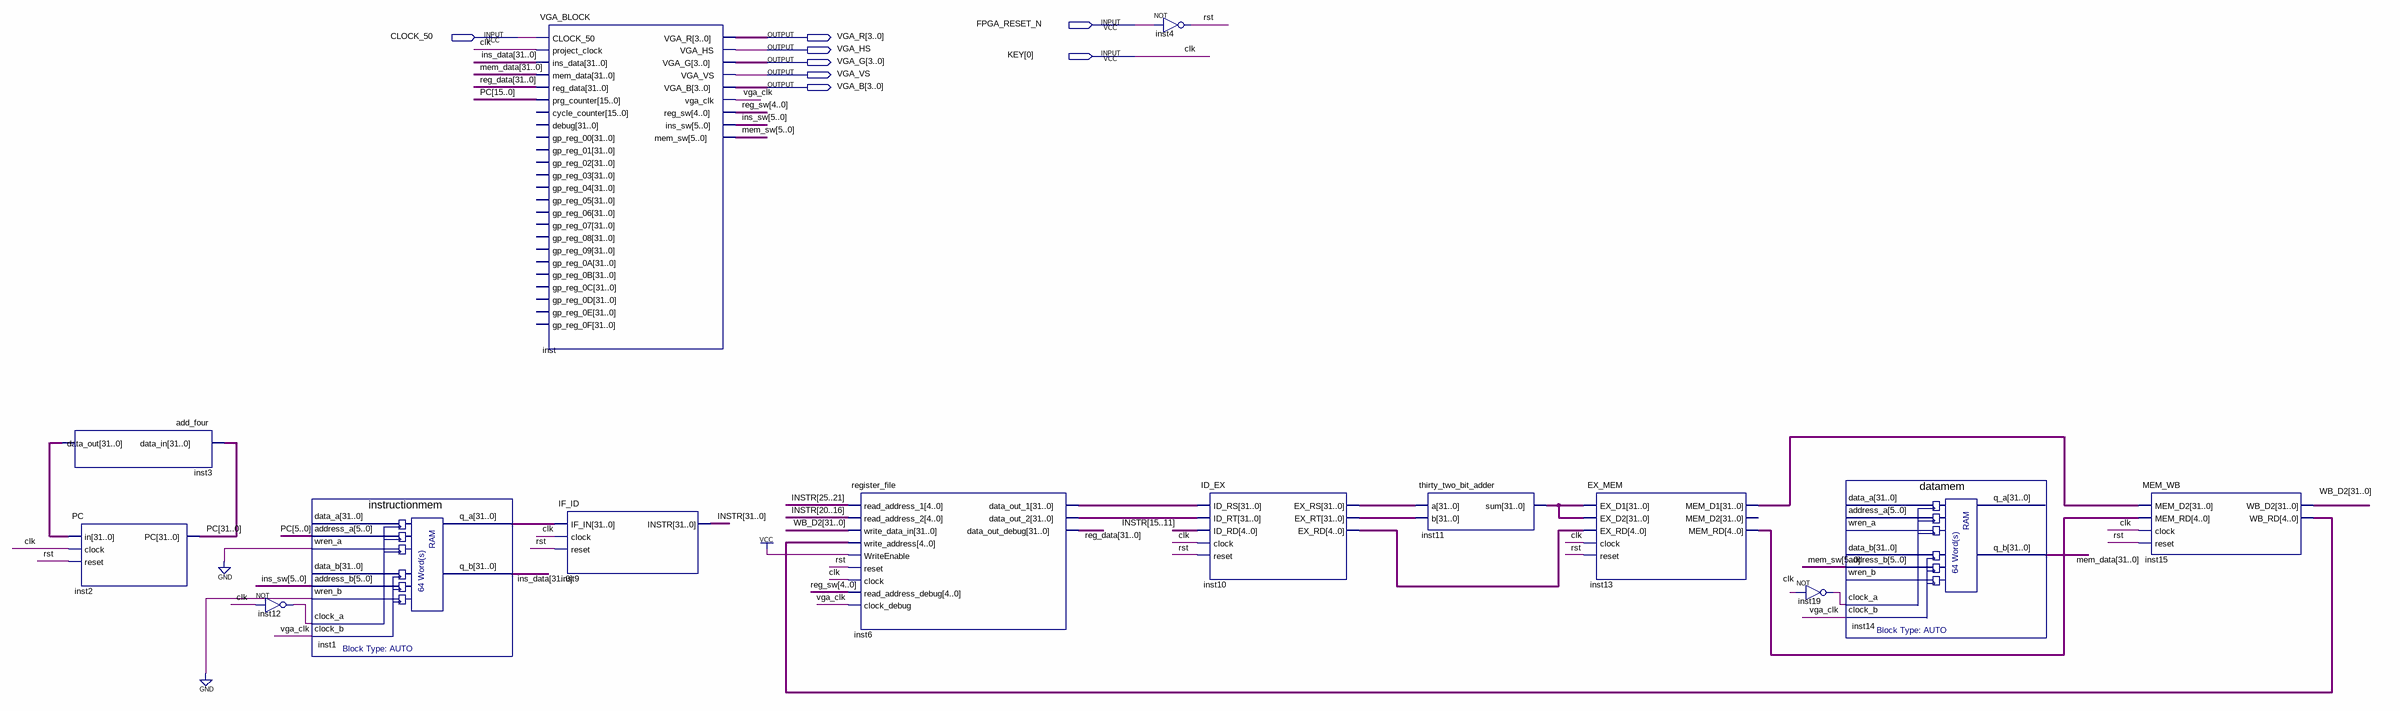
[diagram p0: schematic sheet]
// Quartus schematic lab5top.bdf as structural Verilog: 14 symbols, 8 pins
module lab5top (
  input  FPGA_RESET_N,
  input  CLOCK_50,
  input  [0:0] KEY,
  output [3:0] VGA_R,
  output VGA_HS,
  output [3:0] VGA_G,
  output VGA_VS,
  output [3:0] VGA_B
);

  wire inst12_out, inst19_out, rst, vga_clk;
  wire [4:0] inst10_ex_rd, inst13_mem_rd, inst15_wb_rd, reg_sw;
  wire [5:0] ins_sw, mem_sw;
  wire [31:0] ins_data, inst1_q_a, inst3_data_out, inst6_data_out_1, inst6_data_out_2, inst10_ex_rs,
       inst10_ex_rt, inst11_sum, inst13_mem_d1, INSTR, mem_data, PC, reg_data, WB_D2;

  add_four inst3 (.data_in(PC), .data_out(inst3_data_out));
  PC inst2 (.in(inst3_data_out), .clock(KEY[0]), .reset(rst), .PC(PC));
  not inst12 (inst12_out, KEY[0]);
  instructionmem inst1 (
    .address_a(PC[5:0]), .wren_a(1'b0), .address_b(ins_sw), .wren_b(1'b0), .clock_a(inst12_out),
    .clock_b(vga_clk), .q_a(inst1_q_a), .q_b(ins_data));  // open: data_a, data_b
  VGA_BLOCK inst (
    .CLOCK_50(CLOCK_50), .project_clock(KEY[0]), .ins_data(ins_data), .mem_data(mem_data),
    .reg_data(reg_data), .prg_counter(PC[15:0]), .VGA_R(VGA_R), .VGA_HS(VGA_HS), .VGA_G(VGA_G),
    .VGA_VS(VGA_VS), .VGA_B(VGA_B), .vga_clk(vga_clk), .reg_sw(reg_sw), .ins_sw(ins_sw), .mem_sw(mem_sw));  // open: cycle_counter, debug, gp_reg_00, gp_reg_01, gp_reg_02, gp_reg_03, gp_reg_04, gp_reg_05, gp_reg_06, gp_reg_07, gp_reg_08, gp_reg_09, gp_reg_0A, gp_reg_0B, gp_reg_0C, gp_reg_0D, gp_reg_0E, gp_reg_0F
  IF_ID inst9 (.IF_IN(inst1_q_a), .clock(KEY[0]), .reset(rst), .INSTR(INSTR));
  register_file inst6 (
    .read_address_1(INSTR[25:21]), .read_address_2(INSTR[20:16]), .write_data_in(WB_D2),
    .write_address(inst15_wb_rd), .WriteEnable(1'b1), .reset(rst), .clock(KEY[0]),
    .read_address_debug(reg_sw), .clock_debug(vga_clk), .data_out_1(inst6_data_out_1),
    .data_out_2(inst6_data_out_2), .data_out_debug(reg_data));
  not inst4 (rst, FPGA_RESET_N);
  ID_EX inst10 (
    .ID_RS(inst6_data_out_1), .ID_RT(inst6_data_out_2), .ID_RD(INSTR[15:11]), .clock(KEY[0]), .reset(rst),
    .EX_RS(inst10_ex_rs), .EX_RT(inst10_ex_rt), .EX_RD(inst10_ex_rd));
  thirty_two_bit_adder inst11 (.a(inst10_ex_rs), .b(inst10_ex_rt), .sum(inst11_sum));
  EX_MEM inst13 (
    .EX_D1(inst11_sum), .EX_D2(inst11_sum), .EX_RD(inst10_ex_rd), .clock(KEY[0]), .reset(rst),
    .MEM_D1(inst13_mem_d1), .MEM_RD(inst13_mem_rd));  // open: MEM_D2
  not inst19 (inst19_out, KEY[0]);
  datamem inst14 (
    .address_b(mem_sw), .clock_a(inst19_out), .clock_b(vga_clk), .q_b(mem_data));  // open: data_a, address_a, wren_a, data_b, wren_b, q_a
  MEM_WB inst15 (
    .MEM_D2(inst13_mem_d1), .MEM_RD(inst13_mem_rd), .clock(KEY[0]), .reset(rst), .WB_D2(WB_D2),
    .WB_RD(inst15_wb_rd));

  // Other names for the same wires on the sheet: clk = KEY[0]
endmodule
